# EAGLE schematic smokeyamp (EAGLE 7.2.0)
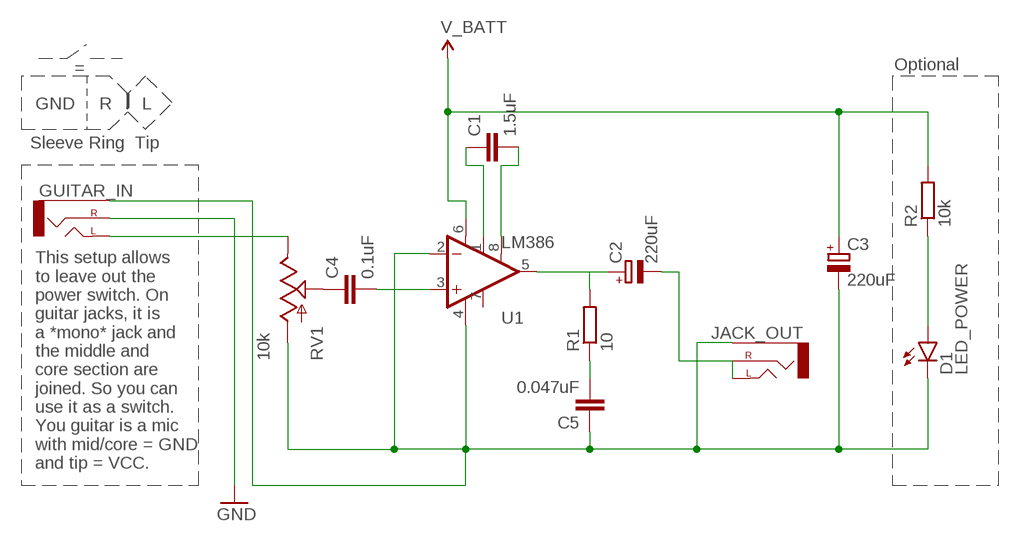
[diagram p0: schematic, sheet 1]

## Parts
C1  1.5uF  C-EU025-024X044  [C025-024X044]
C2  220uF  CPOL-EUE2.5-5  [E2,5-5]
C3  220uF  CPOL-EUE2.5-5  [E2,5-5]
C4  0.1uF  C-EU025-024X044  [C025-024X044]
C5  0.047uF  C-EU025-024X044  [C025-024X044]
D1  LED_POWER  LED-FKIT-1206  [FKIT-LED-1206]
GUITAR_IN  AUDIO-JACK2.5MM  [STEREOJACK2.5MM_STEREOJACK2.5MM]
JACK_OUT  AUDIO-JACK2.5MM  [STEREOJACK2.5MM_STEREOJACK2.5MM]
R1  10  R-EU_0207/10  [0207/10]
R2  10k  R-EU_0207/10  [0207/10]
RV1  10k  POT-RV16AF-20  [POT_ALPHA_RV16AF-20]
U1  LM386  [DIP08]

## Nets
GND: C3.- C5.1 D1.C GUITAR_IN.RING1(SLEEVE) JACK_OUT.RING1(SLEEVE) RV1.1(A) U1.2(-IN) U1.4(V-)
GND_RETURN: GUITAR_IN.TIP(RIGHT) ; supply symbol labelled GND
N$1: C1.1 U1.1(GAIN)
N$2: C1.2 U1.8(GAIN)
N$3: C4.2 U1.3(+IN)
N$4: C2.+ R1.2 U1.5(OUT)
N$5: C5.2 R1.1
N$6: D1.A R2.1
N$7: C2.- JACK_OUT.SHIELD(LEFT) JACK_OUT.TIP(RIGHT)
N$9: C4.1 RV1.2(S)
N$11: GUITAR_IN.SHIELD(LEFT) RV1.3(E)
V_BATT: C3.+ R2.2 U1.6(V+)
Unconnected: U1.7(BP)

## Notes on the sheet
- = | Optional
- GND | R | L
- Sleeve | Ring | Tip
- This setup allows
  to leave out the
  power switch. On
  guitar jacks, it is
  a *mono* jack and
  the middle and 
  core section are 
  joined. So you can
  use it as a switch.
  You guitar is a mic
  with mid/core = GND
  and tip = VCC.

## Library data of the parts
C1 C4 C5 = resistor:C-EU: CAPACITOR, European symbol
C2 C3 = resistor:CPOL-EU: POLARIZED CAPACITOR, European symbol
D1 = SparkFun-LED:LED: LEDs Standard schematic elements and footprints for 5mm, 3mm, 1206, and 0603 sized LEDs. 5mm - Spark Fun Electronics SKU : COM-00529 (and others)
GUITAR_IN JACK_OUT = SparkFun-Connectors:AUDIO-JACK: 3.5mm Audio Jack Simple 3.5mm common PCB mount audio jack. Variant PTH is our storefront SKU PRT-08032
R1 R2 = resistor:R-EU_: RESISTOR, European symbol
RV1 = SparkFun-Electromechanical:POT
U1 = SparkFun-AnalogIC:LM386: low voltage audio power amplifier